# EAGLE design node5-debug-cable (EAGLE 5.10)
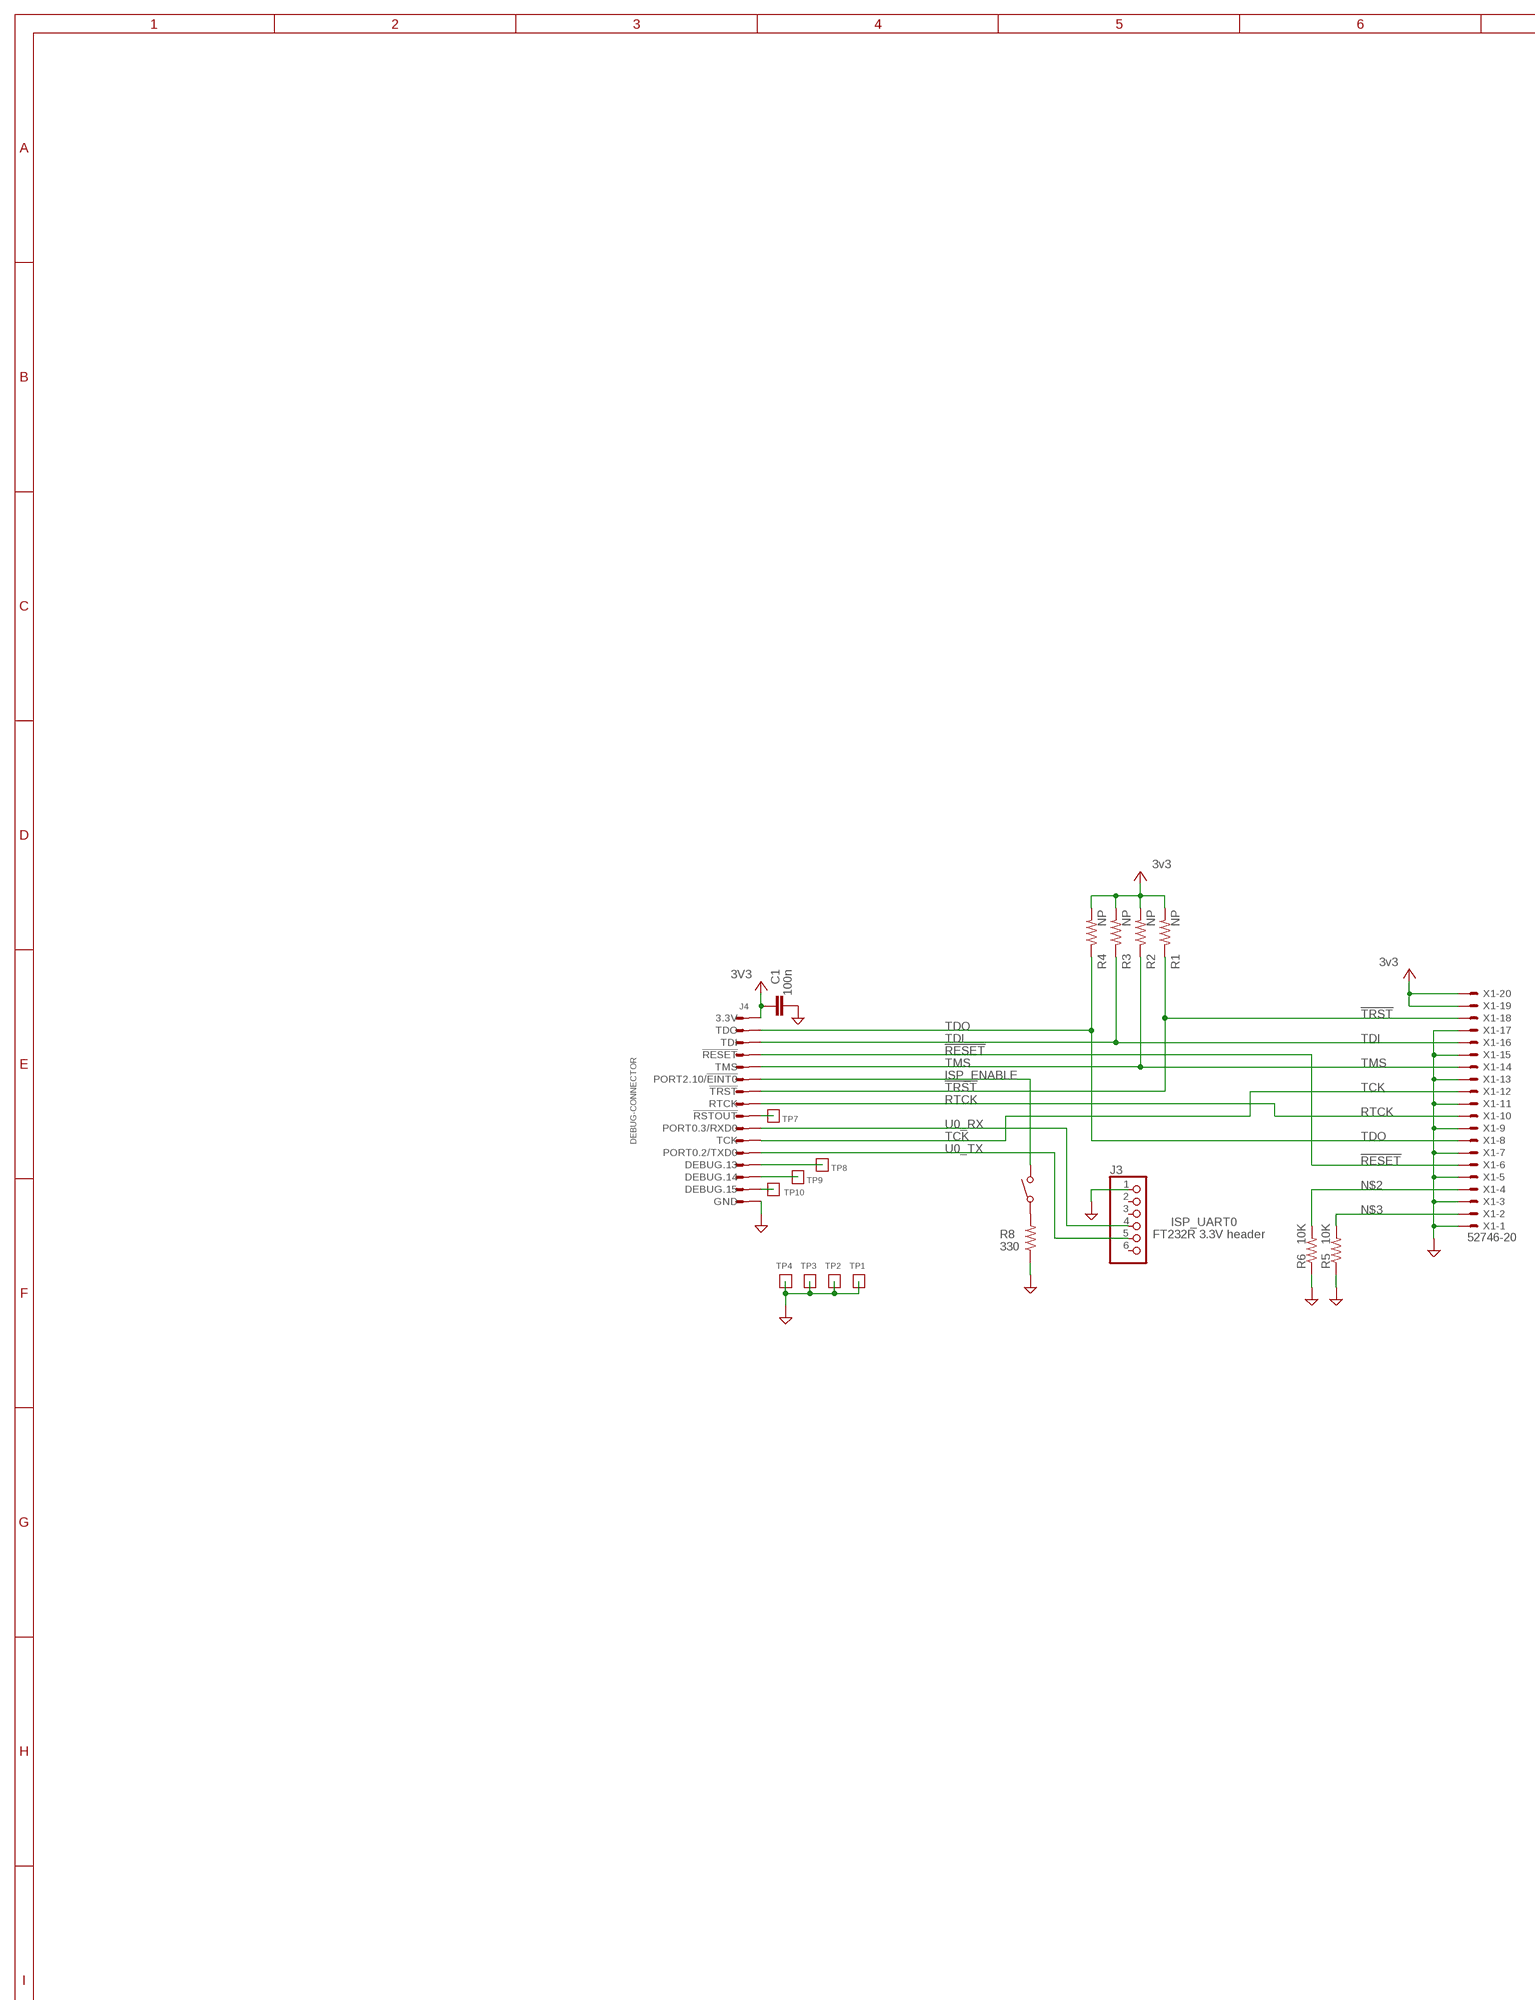
[diagram p0: schematic, sheet 1, part 1 of 2]
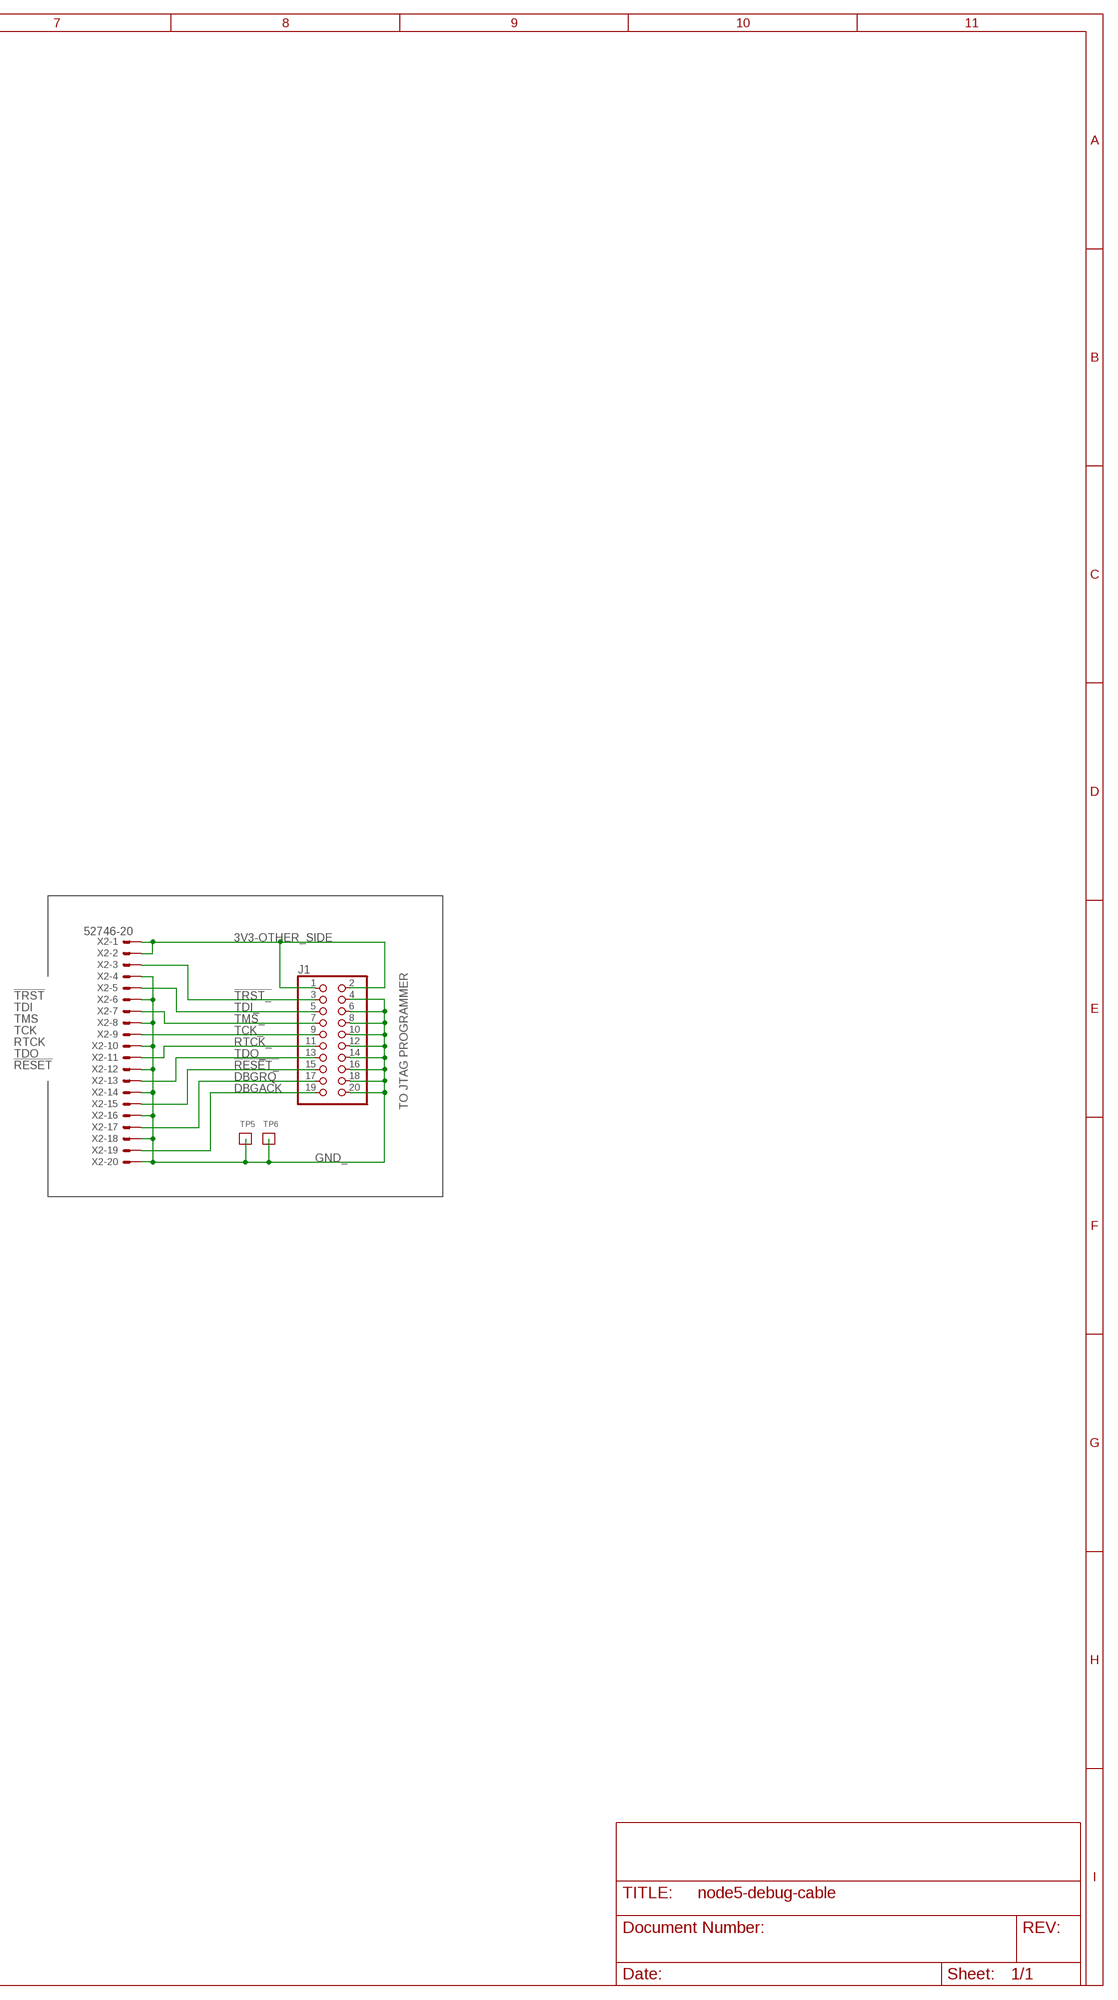
[diagram p1: schematic, sheet 1, part 2 of 2]

## Parts
C1  100n  C-EUC0603K  [C0603K]
J1  PINHEADER-2X10-0.1-RTANGLE  [PINHEADER-2X10/90-0.1]
J3  FT232R 3.3V header  PINHD-1X6  [1X06]
J4  DEBUG-CONNECTOR  [JST-16R-JED]
R1  NP  R-US_R0603  [R0603]
R2  NP  R-US_R0603  [R0603]
R3  NP  R-US_R0603  [R0603]
R4  NP  R-US_R0603  [R0603]
R5  10K  R-US_R0603  [R0603]
R6  10K  R-US_R0603  [R0603]
R8  330  R-US_R0603  [R0603]
SW1  SW-CK-SLIDE-0.1IN  [SW-CK-SLIDE]
TP1  TEST-POINT  [2MM-TEST-POINT]
TP2  TEST-POINT  [2MM-TEST-POINT]
TP3  TEST-POINT  [2MM-TEST-POINT]
TP4  TEST-POINT  [2MM-TEST-POINT]
TP5  TEST-POINT  [2MM-TEST-POINT]
TP6  TEST-POINT  [2MM-TEST-POINT]
TP7  TEST-POINT  [2MM-TEST-POINT]
TP8  TEST-POINT  [2MM-TEST-POINT]
TP9  TEST-POINT  [2MM-TEST-POINT]
TP10  TEST-POINT  [2MM-TEST-POINT]
X1  52746-20  [52746-20]
X2  52746-20  [52746-20]

## Nets
3V3: C1.1 J4.1(3.3V) R1.2 R2.2 R3.2 R4.2 X1.19 X1.20 ; supply symbol labelled 3v3
3V3-OTHER_SIDE: J1.1 J1.2 X2.1 X2.2
!RESET: J4.4(!RESET) X1.6
!RESET_: J1.15 X2.15
!TRST: J4.7(!TRST) R1.1 X1.18
!TRST_: J1.3 X2.3
DBGACK: J1.19 X2.19
DBGRQ: J1.17 X2.17
GND: C1.2 J3.1 J4.16(GND) R5.1 R6.1 R8.1 TP1.1 TP2.1 TP3.1 TP4.1 X1.1 X1.3 X1.5 X1.7 X1.9 X1.11 X1.13 X1.15 X1.17
GND_: J1.4 J1.6 J1.8 J1.10 J1.12 J1.14 J1.16 J1.18 J1.20 TP5.1 TP6.1 X2.4 X2.6 X2.8 X2.10 X2.12 X2.14 X2.16 X2.18 X2.20
ISP_ENABLE: J4.6(PORT2.10/!EINT0) SW1.2(NO)
N$1: J4.9(!RSTOUT) TP7.1
N$2: R6.2 X1.4
N$3: R5.2 X1.2
N$4: R8.2 SW1.1(COM)
N$5: J4.13(DEBUG.13) TP8.1
N$6: J4.14(DEBUG.14) TP9.1
N$7: J4.15(DEBUG.15) TP10.1
RTCK: J4.8(RTCK) X1.10
RTCK_: J1.11 X2.11
TCK: J4.11(TCK) X1.12
TCK_: J1.9 X2.9
TDI: J4.3(TDI) R3.1 X1.16
TDI_: J1.5 X2.5
TDO: J4.2(TDO) R4.1 X1.8
TDO_: J1.13 X2.13
TMS: J4.5(TMS) R2.1 X1.14
TMS_: J1.7 X2.7
U0_RX: J3.4 J4.10(PORT0.3/RXD0)
U0_TX: J3.5 J4.12(PORT0.2/TXD0)
Unconnected: J3.2 J3.3 J3.6

## Notes on the sheet
- TO JTAG PROGRAMMER
- ISP_UART0

## Library data of the parts
C1 = Tova:C-EU: CAPACITOR, European symbol
J1 = apdm:PINHEADER-2X10-*: Pin Header 2x10
J3 = pinhead:PINHD-1X6: PIN HEADER
J4 = ScottsLib:DEBUG-CONNECTOR
R1-R6 R8 = rcl:R-US_: RESISTOR, American symbol
SW1 = Tova:SW-CK-SLIDE-0.1IN
TP1-TP10 = Tova:TEST-POINT
X1 X2 = con-molex:52746-20: FPC Connector ZIF for SMT 0.5mm Source: http://www.farnell.com/datasheets/73044.pdf [DWG. NO. (Sheet 1 OF 2) SD-52746-**17] Distributor: Farnell 9786350

## Board
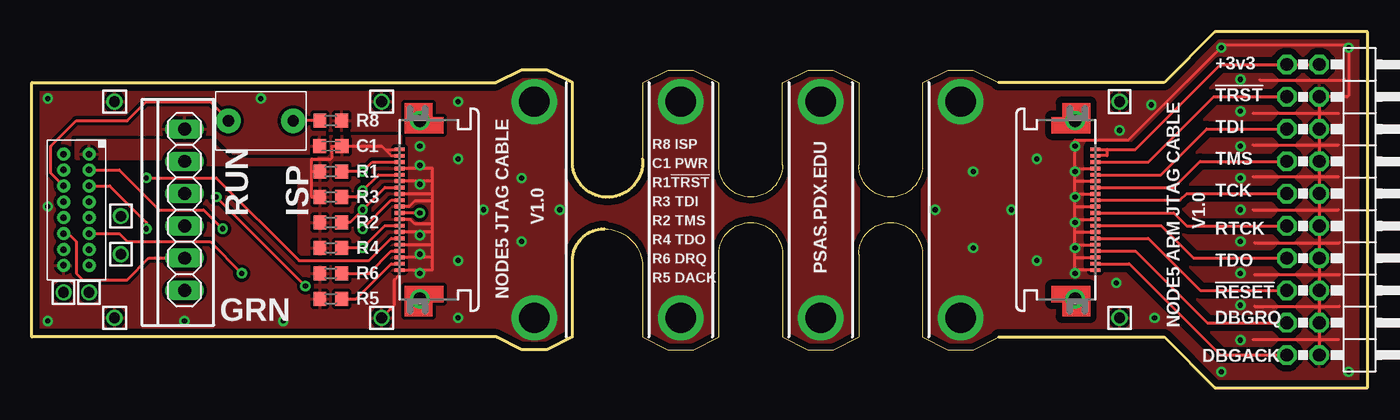
[diagram p2: board, top side]
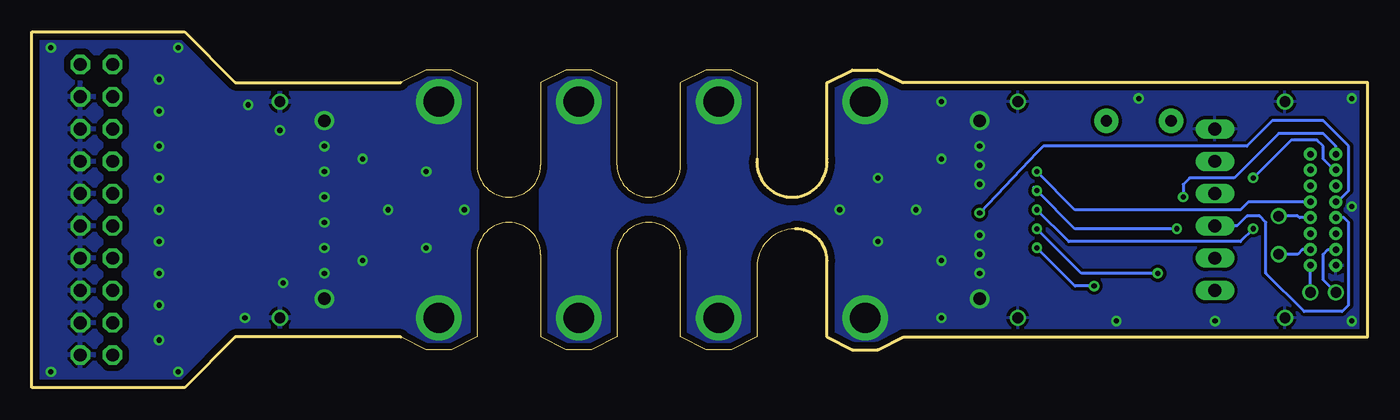
[diagram p3: board, bottom side, seen from below]

Size 105 x 28 mm. Coordinates in mm from the lower left corner, seen from the top.
Outline: 48,9.64 48,9.5
Outline: 48,9.5 48,4 50,3 52,3 54,4 54,10.5 arc-180 59,10.5 59,4 61,3 63,3 65,4 65,10.5 arc-180 70,10.5 70,4 72,3 74,3 76,4 89,4 93,0 105,0 105,28 93,28 89,24 76,24 74,25 72,25 70,24 70,17.5 arc-180 65,17.5 65,24 63,25 61,25 59,24 59,17.5 arc-180 54,17.5 54,24 52,25 50,25 48,24 48,18 arc-190 42.5,18 42.5,24 40.5,25 38.5,25 36.5,24 0,24 0,4 36.5,4 38.5,3 40.5,3 42.5,4 42.5,10 arc-90 45,12.5 arc-90 48,9.5
Copper layers (1*16): Top 0.0178mm / dielectric 1.4986mm / Bottom 0.0178mm
Design rules "SSC-EAGLE-2Lyr_v1.0.0.3": minimum track width 6mil, minimum drill 14mil, track to track 6mil, track to pad 6mil, pad to pad 6mil, via to via 6mil, smd to smd 6mil, copper to edge 20mil, drill to drill 16mil, minimum pad ring 8mil, minimum via ring 8mil, stop-mask expansion 3mil, vias tented up to drill 0mil, thermal gap 10mil

### Footprints (pad centres in the part's own frame; a part is rotated, then mirrored left to right if it is on the bottom)
C0603K = smd 1.05 x 1.08: 1 -0.875,0; 2 0.875,0
PINHEADER-2X10/90-0.1 = drill 1.016 octagon: 1 -11.43,-6.35; 2 -11.43,-3.81; 3 -8.89,-6.35; 4 -8.89,-3.81; 5 -6.35,-6.35; 6 -6.35,-3.81; 7 -3.81,-6.35; 8 -3.81,-3.81; 9 -1.27,-6.35; 10 -1.27,-3.81; 11 1.27,-6.35; 12 1.27,-3.81; 13 3.81,-6.35; 14 3.81,-3.81; 15 6.35,-6.35; 16 6.35,-3.81; 17 8.89,-6.35; 18 8.89,-3.81; 19 11.43,-6.35; 20 11.43,-3.81
1X06 = drill 1.016 long: 1 -6.35,0; 2 -3.81,0; 3 -1.27,0; 4 1.27,0; 5 3.81,0; 6 6.35,0
JST-16R-JED = drill 0.508 pad 1.016 round: 1 2,4.375; 2 0,4.375; 3 2,3.125; 4 0,3.125; 5 2,1.875; 6 0,1.875; 7 2,0.625; 8 0,0.625; 9 2,-0.625; 10 0,-0.625; 11 2,-1.875; 12 0,-1.875; 13 2,-3.125; 14 0,-3.125; 15 2,-4.375; 16 0,-4.375
R0603 = smd 1 x 1.1: 1 -0.85,0; 2 0.85,0
SW-CK-SLIDE = drill 0.889 pad 1.905 round: 1 -2.54,0; 2 2.54,0
2MM-TEST-POINT = drill 0.838 pad 1.27 round: 1 0,0
52746-20 = smd 0.3 x 0.8: 1 -4.75,0.6; 2 -4.25,0.6; 3 -3.75,0.6; 4 -3.25,0.6; 5 -2.75,0.6; 6 -2.25,0.6; 7 -1.75,0.6; 8 -1.25,0.6; 9 -0.75,0.6; 10 -0.25,0.6; 11 0.25,0.6; 12 0.75,0.6; 13 1.25,0.6; 14 1.75,0.6; 15 2.25,0.6; 16 2.75,0.6; 17 3.25,0.6; 18 3.75,0.6; 19 4.25,0.6; 20 4.75,0.6

### Placement (x,y rotation side)
C1  23.5,19 180 top
J1  105,14 270 top
J3  12,14 270 top
J4  2.5,14 0 top
R1  23.5,17 180 top
R2  23.5,13 180 top
R3  23.5,15 180 top
R4  23.5,11 180 top
R5  23.5,7 0 top
R6  23.5,9 0 top
R8  23.5,21 180 top
SW1  18,21 180 top
TP1  6.5,22.5 90 top
TP2  6.5,5.5 90 top
TP3  27.5,22.5 90 top
TP4  27.5,5.5 90 top
TP5  85.5,5.5 90 top
TP6  85.5,22.5 0 top
TP7  7,13.5 0 top
TP8  7,10.5 0 top
TP9  2.5,7.5 0 top
TP10  4.5,7.5 0 top
X1  29.5,14 90 top
X2  83,14 270 top

### Tracks (layer width: path | path; a pad name or v marks a point on that pad's centre or on a via)
3V3
  Top 0.25: 27.75,18.75 X1.20 | 27.75,18.75 27.5,19 C1.1 23.6,19 23.6,18.1 23.5,18 22,18 22,17 | X1.19 28.25,18.25 27.75,18.75 | 22,17 22,15 R3.2 | 22,17 R1.2
  pour Top (isolate 0.25): 29,19.8 29,17.5 28.5,17.5 28.5,10.5 21,10.5 21,17.5 12,17.5 12,18 3.5,18 3.5,19.5 14,19.5 15.5,18 22.5,18 23.5,19.8
3V3-OTHER_SIDE
  Top 0.25: X2.1 84.5,18.75 | 84.5,18.75 84.5,18.25 X2.2 | 84.5,18.75 86.75,18.75 93.43,25.43 J1.1 J1.2
!RESET  (via drill 0.41)
  Top 0.25: X1.6 28.25,11.75 26.5,10 21,10 14.5,16.5 v9,16.5
  Bottom 0.25: J4.4 2.62,17.12 3.5,18 3.5,19 4,19.5 6,19.5 v9,16.5
!RESET_
  Top 0.25: X2.15 87.75,11.75 91.85,7.65 J1.15
!TRST  (via drill 0.41)
  Top 0.25: X1.18 26.75,17.75 v26,17 R1.1
  Bottom 0.25: J4.7 9.38,14.62 10,14 23,14 v26,17
!TRST_
  Top 0.25: X2.3 87.75,17.75 92.89,22.89 J1.3
DBGACK
  Top 0.25: X2.19 86.25,9.75 93.43,2.57 J1.19
DBGRQ
  Top 0.25: X2.17 86.75,10.75 92.39,5.11 J1.17
GND  (via drill 0.41, 1, 2.37)
  Top 0.25: X1.17 31.5,17.25 31.5,16.25 | 31.5,10.25 31.5,11.25 | 31.5,16.25 X1.15 | 31.5,15.25 X1.13 | 31.5,15.25 31.5,16.25 | 31.5,14.7 30.1,14.7 29.65,14.25 X1.11 | 31.5,14.7 31.5,15.25 | 31.5,12.25 31.5,12.9 | 31.5,12.9 31.5,14.7 | 31.5,12.25 X1.7 | 31.5,11.25 X1.5 | 31.5,11.25 31.5,12.25 | 31.5,10.25 X1.3 | 31.5,10.25 31.5,9.25 X1.1 28.9,8.9 28.5,8.5 28.5,6.5 TP4.1 | X1.9 29.75,13.25 30.1,12.9 31.5,12.9
  other vias: 39.5,22.5 39.5,5.5 51,22.5 51,5.5 62,22.5 62,5.5 30.5,7 30.5,21 30.5,12 30.5,19 30.5,17.5 30.5,16 30.5,9 30.5,10.5 35.5,14 38.5,11.5 38.5,16.5 33.5,10 33.5,22.5 33.5,5.5 33.5,18 41.5,14 1.25,5.25 1.25,22.75 1.25,14.25 12,5.25 19.75,5.25 18,22.75
  pour Top (isolate 0.25, rank 3): 65,2.5 65,24.5 0,25 0,3
  pour Bottom (isolate 0.25): 65,3 65,25 0,25 0,3
GND_  (via drill 0.41, 1, 2.37)
  Top 0.25: X2.20 82,9.25 82,10.25 | 82,14.25 v82,15 | 82,16.25 82,17.25 | 82,16.25 X2.6 | v82,15 82,16.25 | X2.8 82,15.25 v82,15 | 82,14.25 X2.10 | 82,13.25 82,14.25 | 82,13.25 X2.12 | 82,12.25 X2.14 | 82,12.25 82,13.25 | 82,11.25 X2.16 | 82,11.25 82,12.25 | 82,10.25 X2.18 | 82,10.25 82,11.25 | J1.20 J1.18 J1.16 J1.14 J1.12 J1.10 J1.8 J1.6 J1.4 103.39,22.89 103.5,23 103.5,27 93.7,27 86.2,19.5 82,19.5 82,17.25 | 82,17.25 X2.4 | 96.5,24.2 103.2,24.2 | 96,21.6 102.7,21.6 | 96,19.1 102.7,19.1 | 96,16.6 102.7,16.6 | 96,14 102.7,14 | 96.1,11.4 102.8,11.4 | 96.1,8.9 102.8,8.9 | 96.1,6.4 102.8,6.4 | 96,3.8 102.7,3.8
  other vias: 73,22.5 73,5.5 82,21 82,7 82,19 82,17 82,9 82,11 82,13 103.5,26.75 71,14 103.5,1.25 93.5,1.25 93.5,26.75 95,24.25 95,21.75 95,19 95,16.5 95,14 95,11.5 95,9 95,6.5 95,3.75 85.25,8.25 85.5,20.25 88,22.25 88.25,5.5 79,10 79,18 77,14 74,17 74,11
  pour Top (isolate 0.508): 70,25 89,25 93,28 105,28 105,0 93,0 89,3 70,3
  pour Bottom (isolate 0.508): 70,25 89,25 93,28 105,28 105,0 93,0 89,3 70,3
ISP_ENABLE
  Top 0.25: SW1.2 15.46,21.04 14,22.5 9,22.5 7.5,21 3.5,21 1.5,19 1.5,16.88 J4.6
N$1
  Bottom 0.25: J4.9 5.38,13.38 5.5,13.5 TP7.1
N$2
  Top 0.25: X1.4 28.25,10.75 26.5,9 R6.2
N$3
  Top 0.25: X1.2 28.25,9.75 25.5,7 R5.2
N$4
  Top 0.25: R8.2 SW1.1
N$5
  Bottom 0.25: TP8.1 5.5,10.5 5.12,10.88 J4.13
N$6
  Bottom 0.25: J4.14 3.12,10.88 3.5,10.5 3.5,8.5 TP9.1
N$7
  Bottom 0.25: TP10.1 J4.15
RTCK  (via drill 0.41)
  Top 0.25: v30.5,13.75 X1.10
  Bottom 0.25: v30.5,13.75 26,18.5 25.5,19 9.5,19 7.5,21 3.5,21 1.5,19 1.5,15.5 2.38,14.62 J4.8
RTCK_
  Top 0.25: X2.11 89.75,13.75 90.77,12.73 J1.11
TCK  (via drill 0.41)
  Top 0.25: X1.12 28.25,14.75 v26,12.5 | J4.11 6.88,12.12 7.5,11.5 14,11.5 v16.5,9
  Bottom 0.25: v26,12.5 22.5,9 v16.5,9
TCK_
  Top 0.25: X2.9 90.25,14.75 90.77,15.27 J1.9
TDI  (via drill 0.41)
  Top 0.25: R3.1 25.5,15 v26,15.5 27.25,16.75 X1.16 | J4.3 6.88,17.12 10,14 13.5,14 v15,12.5
  Bottom 0.25: 26.25,15.75 v26,15.5 23,12.5 v15,12.5
TDI_
  Top 0.25: X2.5 88.75,16.75 92.35,20.35 J1.5
TDO  (via drill 0.41)
  Top 0.25: X1.8 27.75,12.75 v26,11 R4.1 | v14.5,15 v21.5,8
  Bottom 0.25: J4.2 2.5,19 3.5,20 7,20 10.5,16.5 14,16.5 14.5,16 v14.5,15 | v26,11 23,8 v21.5,8
TDO_
  Top 0.25: X2.13 88.75,12.75 91.31,10.19 J1.13
TMS  (via drill 0.41)
  Top 0.25: X1.14 27.75,15.75 v26,14 25,13 R2.1 | J4.5 6.12,15.88 9,13 v9,12.5
  Bottom 0.25: v9,12.5 10,11.5 23.5,11.5 v26,14
TMS_
  Top 0.25: X2.7 89.75,15.75 91.81,17.81 J1.7
U0_RX
  Bottom 0.25: J4.10 1.88,13.38 1.5,13 1.5,6.5 2,6 5,6 8,9 8,13 8.5,13.5 9.5,13.5 10.27,12.73 J3.4
U0_TX
  Top 0.25: J4.12 2.88,12.12 3.5,11.5 3.5,9 4,8.5 7.5,8.5 9.19,10.19 J3.5

### Text on the board
tPlace: +3v3 | !TRST | R8 | TDI | R8 ISP | C1 | TMS | C1 PWR | R1 | V1.0 | R1!TRST! | TCK | RUN | ISP | R3 | R3 TDI | R2 TMS | R2 | V1.0 | RTCK | R4 TDO | R4 | R6 DRQ | TDO | PSAS.PDX.EDU | R6 | R5 DACK | NODE5 JTAG CABLE | !RESET | R5 | GRN | NODE5 ARM JTAG CABLE | DBGRQ | DBGACK